# Altium schematic sheet Module Output Connector.SchDoc: Module Output Connector
size 292 x 193 mm; SheetNumber: 44; SheetTotal: 44
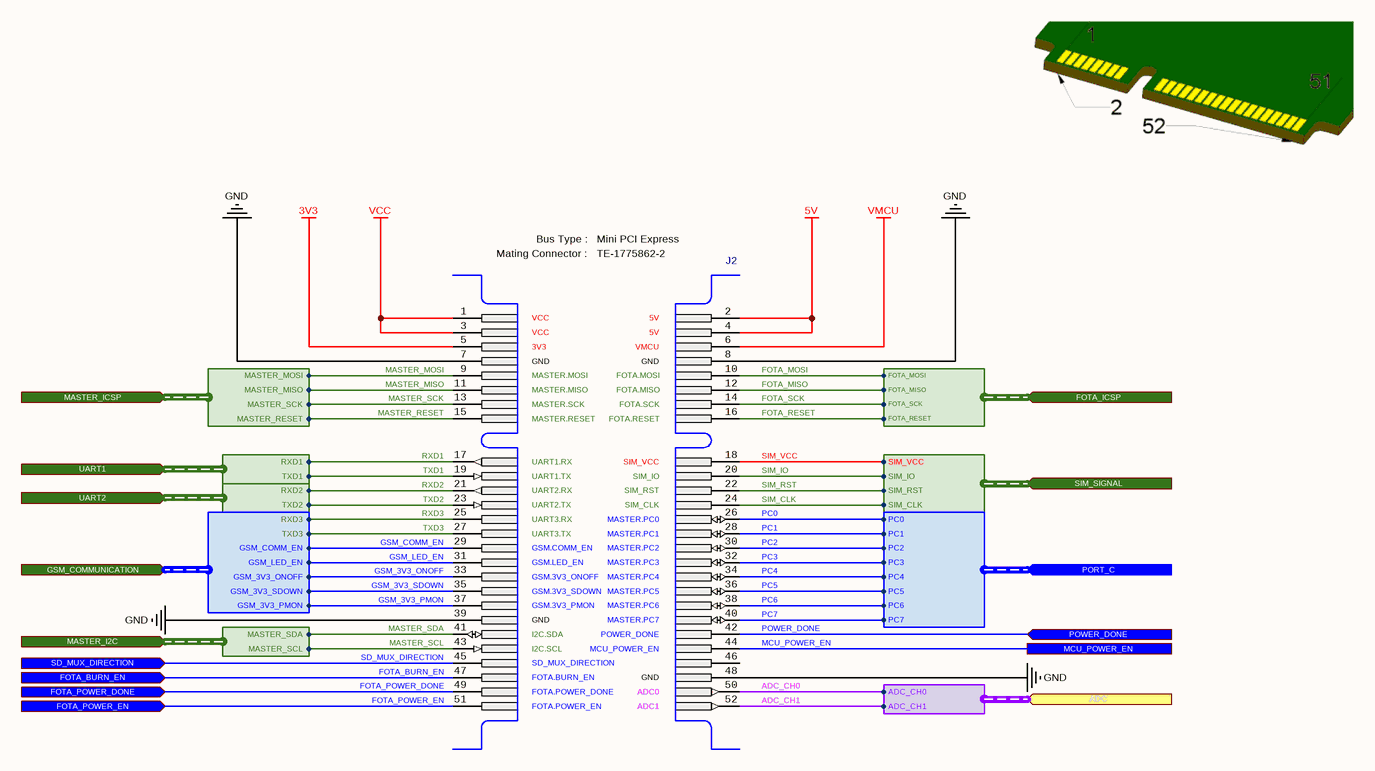
[diagram p0: Module Output Connector.SchDoc]

## Parts
J2  BUS Type: Mini PCI Express  Mating Connector: TE-1775862-2  [PCB - Mini PCI Express]  (hidden comment: Mini PCI Express Gold Finger)  (net tie, no BOM)

## Ports
ADC (in, harness ADC), FOTA_BURN_EN (in), FOTA_ICSP (in, harness FOTA_ICSP), FOTA_POWER_DONE (in), FOTA_POWER_EN (in), GSM_COMMUNICATION (in, harness GSM_COMMUNICATION), MASTER_I2C (in, harness MASTER_I2C), MASTER_ICSP (in, harness MASTER_ICSP), MCU_POWER_EN, PORT_C (in, harness PORT_C), POWER_DONE (in), SD_MUX_DIRECTION (in), SIM_SIGNAL (in, harness SIM_SIGNAL), UART1 (in, harness UART1), UART2 (in, harness UART2)

## Harnesses
SIM_SIGNAL: SIM_VCC, SIM_IO, SIM_RST, SIM_CLK
FOTA_ICSP: FOTA_MOSI, FOTA_MISO, FOTA_SCK, FOTA_RESET
ADC: ADC_CH0, ADC_CH1
MASTER_ICSP: MASTER_MOSI, MASTER_MISO, MASTER_SCK, MASTER_RESET
UART1: RXD1, TXD1
UART2: RXD2, TXD2
GSM_COMMUNICATION: GSM_3V3_ONOFF, GSM_LED_EN, GSM_COMM_EN, GSM_3V3_SDOWN, GSM_3V3_PMON, RXD3, TXD3
PORT_C: PC0, PC1, PC2, PC3, PC4, PC5, PC7, PC6
MASTER_I2C: MASTER_SCL, MASTER_SDA

## Nets
3V3: J2.5(Pin-5)
5V: J2.2(Pin-2) J2.4(Pin-4)
GND: J2.7(Pin-7) J2.8(Pin-8) J2.39(Pin-39) J2.48(Pin-48)
VCC: J2.1(Pin-1) J2.3(Pin-3)
VMCU: J2.6(Pin-6)
ADC_CH0: J2.50(Pin-50) ; port ADC.ADC_CH0
ADC_CH1: J2.52(Pin-52) ; port ADC.ADC_CH1
FOTA_BURN_EN: J2.47(Pin-47) ; port FOTA_BURN_EN
FOTA_MISO: J2.12(Pin-12) ; port FOTA_ICSP.FOTA_MISO
FOTA_MOSI: J2.10(Pin-10) ; port FOTA_ICSP.FOTA_MOSI
FOTA_POWER_DONE: J2.49(Pin-49) ; port FOTA_POWER_DONE
FOTA_POWER_EN: J2.51(Pin-51) ; port FOTA_POWER_EN
FOTA_RESET: J2.16(Pin-16) ; port FOTA_ICSP.FOTA_RESET
FOTA_SCK: J2.14(Pin-14) ; port FOTA_ICSP.FOTA_SCK
GSM_3V3_ONOFF: J2.33(Pin-33) ; port GSM_COMMUNICATION.GSM_3V3_ONOFF
GSM_3V3_PMON: J2.37(Pin-37) ; port GSM_COMMUNICATION.GSM_3V3_PMON
GSM_3V3_SDOWN: J2.35(Pin-35) ; port GSM_COMMUNICATION.GSM_3V3_SDOWN
GSM_COMM_EN: J2.29(Pin-29) ; port GSM_COMMUNICATION.GSM_COMM_EN
GSM_LED_EN: J2.31(Pin-31) ; port GSM_COMMUNICATION.GSM_LED_EN
MASTER_MISO: J2.11(Pin-11) ; port MASTER_ICSP.MASTER_MISO
MASTER_MOSI: J2.9(Pin-9) ; port MASTER_ICSP.MASTER_MOSI
MASTER_RESET: J2.15(Pin-15) ; port MASTER_ICSP.MASTER_RESET
MASTER_SCK: J2.13(Pin-13) ; port MASTER_ICSP.MASTER_SCK
MASTER_SCL: J2.43(Pin-43) ; port MASTER_I2C.MASTER_SCL
MASTER_SDA: J2.41(Pin-41) ; port MASTER_I2C.MASTER_SDA
MCU_POWER_EN: J2.44(Pin-44) ; port MCU_POWER_EN
PC0: J2.26(Pin-26) ; port PORT_C.PC0
PC1: J2.28(Pin-28) ; port PORT_C.PC1
PC2: J2.30(Pin-30) ; port PORT_C.PC2
PC3: J2.32(Pin-32) ; port PORT_C.PC3
PC4: J2.34(Pin-34) ; port PORT_C.PC4
PC5: J2.36(Pin-36) ; port PORT_C.PC5
PC6: J2.38(Pin-38) ; port PORT_C.PC6
PC7: J2.40(Pin-40) ; port PORT_C.PC7
POWER_DONE: J2.42(Pin-42) ; port POWER_DONE
RXD1: J2.17(Pin-17) ; port UART1.RXD1
RXD2: J2.21(Pin-21) ; port UART2.RXD2
RXD3: J2.25(Pin-25) ; port GSM_COMMUNICATION.RXD3
SD_MUX_DIRECTION: J2.45(Pin-45) ; port SD_MUX_DIRECTION
SIM_CLK: J2.24(Pin-24) ; port SIM_SIGNAL.SIM_CLK
SIM_IO: J2.20(Pin-20) ; port SIM_SIGNAL.SIM_IO
SIM_RST: J2.22(Pin-22) ; port SIM_SIGNAL.SIM_RST
SIM_VCC: J2.18(Pin-18) ; port SIM_SIGNAL.SIM_VCC
TXD1: J2.19(Pin-19) ; port UART1.TXD1
TXD2: J2.23(Pin-23) ; port UART2.TXD2
TXD3: J2.27(Pin-27) ; port GSM_COMMUNICATION.TXD3

Not connected (* = marked no-connect by the designer): J2 46(Pin-46)

## Notes on the sheet
- (near J2) VCC
- (near J2) 5V
- (near J2) 3V3
- (near J2) GND
- (near J2) MASTER.MOSI
- (near J2) MASTER.MISO
- (near J2) VMCU
- (near J2) FOTA.MOSI
- (near J2) FOTA.MISO
- (near J2) MASTER.SCK
- (near J2) MASTER.RESET
- (near J2) UART1.RX
- (near J2) FOTA.SCK
- (near J2) FOTA.RESET
- (near J2) SIM_VCC
- (near J2) UART1.TX
- (near J2) UART2.RX
- (near J2) UART2.TX
- (near J2) UART3.RX
- (near J2) UART3.TX
- (near J2) SIM_IO
- (near J2) SIM_RST
- (near J2) SIM_CLK
- (near J2) MASTER.PC0
- (near J2) MASTER.PC1
- (near J2) GSM.COMM_EN
- (near J2) GSM.LED_EN
- (near J2) GSM.3V3_ONOFF
- (near J2) GSM.3V3_SDOWN
- (near J2) GSM.3V3_PMON
- (near J2) MASTER.PC2
- (near J2) MASTER.PC3
- (near J2) MASTER.PC4
- (near J2) MASTER.PC5
- (near J2) MASTER.PC6
- (near J2) I2C.SDA
- (near J2) I2C.SCL
- (near J2) SD_MUX_DIRECTION
- (near J2) FOTA.BURN_EN
- (near J2) MASTER.PC7
- (near J2) POWER_DONE
- (near J2) MCU_POWER_EN
- (near J2) FOTA.POWER_DONE
- (near J2) FOTA.POWER_EN
- (near J2) ADC0
- (near J2) ADC1
- © 2021 All rights reserved.
  This document may not, in whole or in part, be copied, photocopied, reproduced, translated or converted to any electronic or machine readable from without prior written permission of Mehmet Günce Akkoyun.
  Engineer contact : akkoyun@me.com
- Property of
- Engineer :
- Date :
- Size :
- A4
- Time :
- Project :
- Page :
- /
- Customer :
- Product ID :
- Module ID :
- Version :
- File :
- Revision :
- (in symbol PCB - Mini PCI Express & MSATA) Bus Type :; Mating Connector :

## Library data of the parts
J2 = PCB - Mini PCI Express & MSATA: Number of Positions: 52; Pitch: 0.8 mm; ComponentLink1Description: DataSheet; ComponentLink1URL: https://fit-iot.s3.amazonaws.com/download/facet-cards/documents/PCI_Express_miniCard_Electromechanical_specs_rev1.2.pdf